# Altium schematic sheet GPS supply2.SchDoc: GPS traker power supply managment
size A4; DrawnBy: Eng. I.Ivanov; Engineer: Eng. I.Ivanov; Revision: 2; SheetNumber: 2; SheetTotal: 3; PageSetup: Record=PageOptions|CenterHorizontal=True|CenterVertical=True|PrintScale=4.01|XCorrection=1.00|YCorrection=1.00|PrintKind=0|BorderSize=5000000|LeftOffset=0|BottomOffset=0|Orientation=2|PaperLength=1000|PaperWidth=1000|Scale=100|PaperSource=15|PrintQuality=1200|MediaType=1|DitherType=10|PaperKind=A0|PrintScaleMode=1
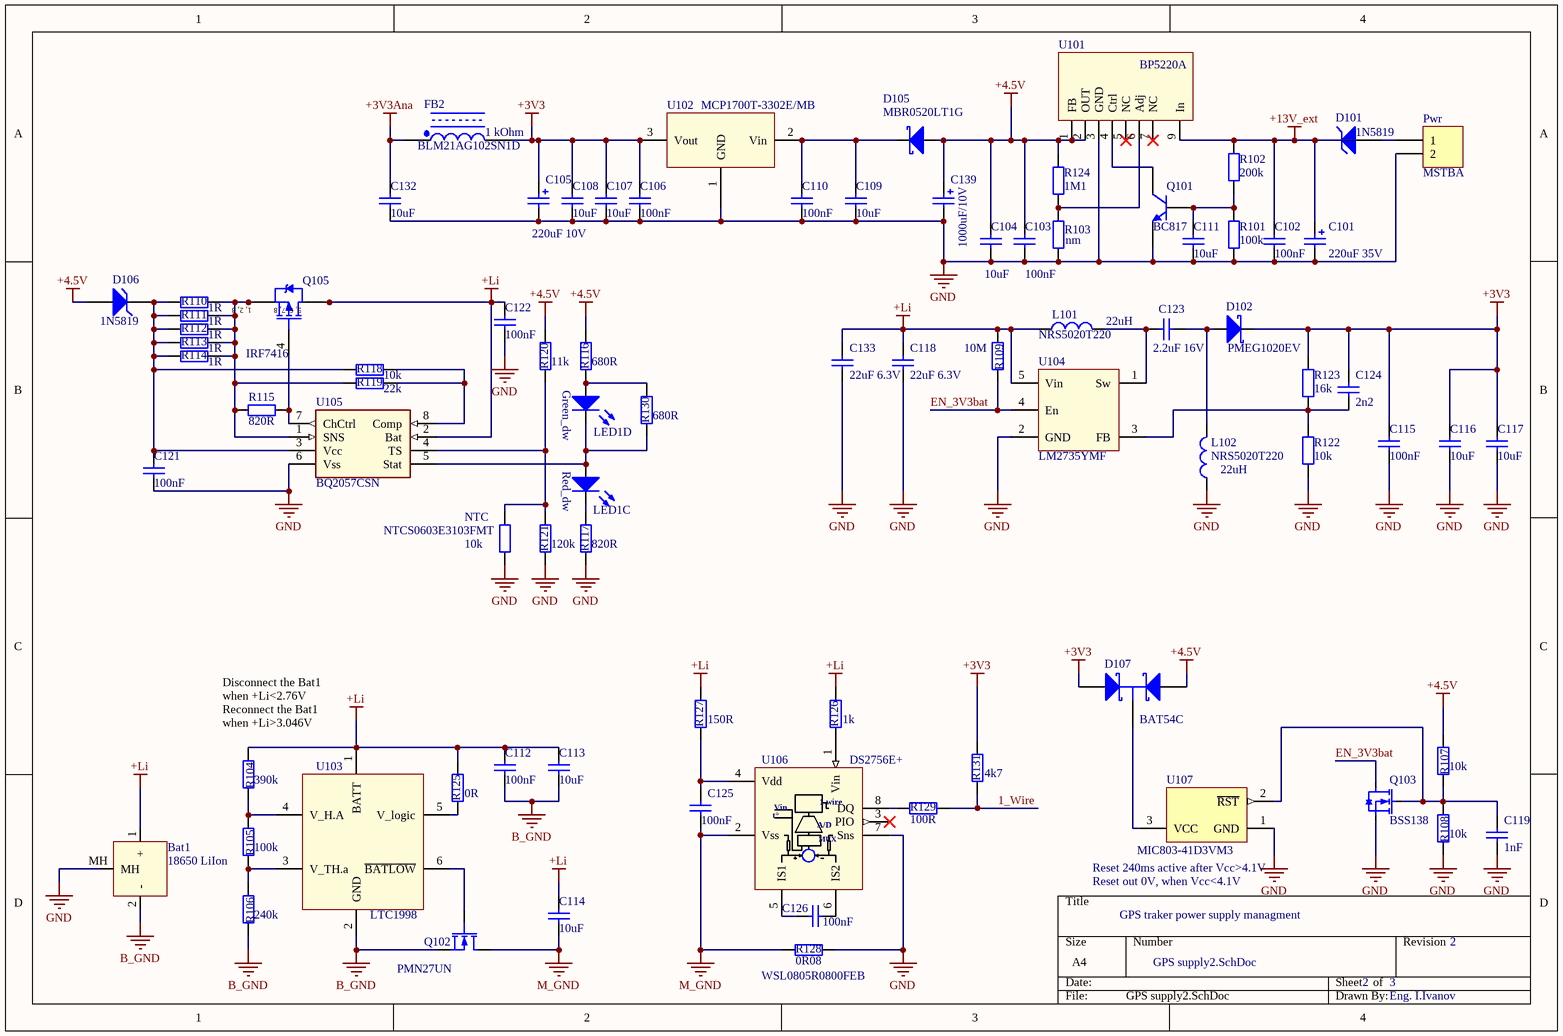
[diagram p0: GPS supply2.SchDoc]

## Parts
Bat1  value 18650 LiIon  [18650]  (hidden comment: LiIon)
C101  220uF 35V  [Cap electrolyt 7]
C102  value 100nF  [2012[0805]]  (hidden comment: Cap Semi)
C103  value 100nF  [2012[0805]]  (hidden comment: Cap Semi)
C104  value 10uF  [2012[0805]]  (hidden comment: Cap Semi)
C105  value 220uF 10V  [Cap electrolyt 8]  (hidden comment: CAP ELECTOLYT)
C106  value 100nF  [2012[0805]]  (hidden comment: Cap Semi)
C107  value 10uF  [2012[0805]]  (hidden comment: Cap Semi)
C108  value 10uF  [2012[0805]]  (hidden comment: Cap Semi)
C109  value 10uF  [2012[0805]]  (hidden comment: Cap Semi)
C110  value 100nF  [2012[0805]]  (hidden comment: Cap Semi)
C111  value 10uF  [2012[0805]]  (hidden comment: Cap Semi)
C112  value 100nF  [2012[0805]]  (hidden comment: Cap Semi)
C113  value 10uF  [2012[0805]]  (hidden comment: Cap Semi)
C114  value 10uF  [2012[0805]]  (hidden comment: Cap Semi)
C115  value 100nF  [2012[0805]]  (hidden comment: Cap Semi)
C116  value 10uF  [2012[0805]]  (hidden comment: Cap Semi)
C117  value 10uF  [2012[0805]]  (hidden comment: Cap Semi)
C118  value 22uF 6.3V  [2012[0805]]  (hidden comment: Cap Semi)
C119  value 1nF  [2012[0805]]  (hidden comment: Cap Semi)
C121  value 100nF  [2012[0805]]  (hidden comment: Cap Semi)
C122  value 100nF  [2012[0805]]  (hidden comment: Cap Semi)
C123  value 2.2uF 16V  [2012[0805]]  (hidden comment: Cap Semi)
C124  value 2n2  [2012[0805]]  (hidden comment: Cap Semi)
C125  value 100nF  [2012[0805]]  (hidden comment: Cap Semi)
C126  value 100nF  [2012[0805]]  (hidden comment: Cap Semi)
C132  value 10uF  [2012[0805]]  (hidden comment: Cap Semi)
C133  value 22uF 6.3V  [2012[0805]]  (hidden comment: Cap Semi)
C139  value 1000uF/10V  [Cap electrolyt 7]  (hidden comment: CAP ELECTOLYT)
D101  1N5819  [DO214]
D102  PMEG1020EV  [SOT-666-DIODE]
D105  MBR0520LT1G  [SOD-123]
D106  1N5819  [DO214]
D107  BAT54C  [SOT23_N]
FB2  BLM21AG102SN1D  value 1 kOhm  [RESC2012N]
L101  value NRS5020T220  Inductance: 22uH  [NRS5020Txxx]  (hidden comment: NRS5020T Taiyo-Yuden inductor)
L102  value NRS5020T220  Inductance: 22uH  [NRS5020Txxx]  (hidden comment: NRS5020T Taiyo-Yuden inductor)
LED1  4x LED's  [515-1061F_2x dual LED's]  (value not drawn)  (parts C,D of 4)
NTC  value 10k  [1608[0603]]  (hidden comment: Res2)
Pwr  MSTBA  [MSTBA2.5/2-G-5.08]
Q101  BC817  [SOT23_N]
Q102  value PMN27UN  [SOT-23-6-MOSFET]  (hidden comment: TrenchMOS™ ultra low level FET)
Q103  value BSS138  [SOT-23_my]  (hidden comment: My BSS138)
Q105  IRF7416  [SO-8_N]
R101  value 100k  [2012[0805]]  (hidden comment: Res2)
R102  value 200k  [2012[0805]]  (hidden comment: Res2)
R103  value nm  [2012[0805]]  (hidden comment: Res2)
R104  value 390k  [2012[0805]]  (hidden comment: Res2)
R105  value 100k  [2012[0805]]  (hidden comment: Res2)
R106  value 240k  [2012[0805]]  (hidden comment: Res2)
R107  value 10k  [2012[0805]]  (hidden comment: Res2)
R108  value 10k  [2012[0805]]  (hidden comment: Res2)
R109  value 10M  [2012[0805]]  (hidden comment: Res2)
R110  value 1R  [2012[0805]]  (hidden comment: Res2)
R111  value 1R  [2012[0805]]  (hidden comment: Res2)
R112  value 1R  [2012[0805]]  (hidden comment: Res2)
R113  value 1R  [2012[0805]]  (hidden comment: Res2)
R114  value 1R  [2012[0805]]  (hidden comment: Res2)
R115  value 820R  [2012[0805]]  (hidden comment: Res2)
R116  value 680R  [2012[0805]]  (hidden comment: Res2)
R117  value 820R  [2012[0805]]  (hidden comment: Res2)
R118  value 10k  [2012[0805]]  (hidden comment: Res2)
R119  value 22k  [2012[0805]]  (hidden comment: Res2)
R120  value 11k  [2012[0805]]  (hidden comment: Res2)
R121  value 120k  [2012[0805]]  (hidden comment: Res2)
R122  value 10k  [2012[0805]]  (hidden comment: Res2)
R123  value 16k  [2012[0805]]  (hidden comment: Res2)
R124  value 1M1  [2012[0805]]  (hidden comment: Res2)
R125  value 0R  [2012[0805]]  (hidden comment: Res2)
R126  value 1k  [2012[0805]]  (hidden comment: Res2)
R127  value 150R  [2012[0805]]  (hidden comment: Res2)
R128  WSL0805R0800FEB  value 0R08  [2012[0805]]
R129  value 100R  [2012[0805]]  (hidden comment: Res2)
R130  value 680R  [2012[0805]]  (hidden comment: Res2)
R131  value 4k7  [2012[0805]]  (hidden comment: Res2)
U101  value BP5220A  [BP502xA]  (hidden comment: Rohm switching DC/DC regulator)
U102  value MCP1700T-3302E/MB  [SOT89_my]  (hidden comment: MCP1700T-xxxx)
U103  value LTC1998  [SOT26A-6N]  (hidden comment: 2.5?A, 1% Accurate  SOT-23 Comparator and Voltage  Reference for Battery Monitoring)
U104  value LM2735YMF  [SOT23-5AN]  (hidden comment: 520kHz Space-Efficient Boost and SEPIC DC-DC  Regulator)
U105  BQ2057CSN  [SO8]
U106  value DS2756E+  [TSSOP 8_My]  (hidden comment: 1 wire fuel gauge)
U107  value MIC803-41D3VM3  [MF03A_N]  (hidden comment: LM809M3-4.00)

## Nets
+3V3: C105.1 C106.2 C107.2 C108.2 C115.2 C116.2 C117.2 C124.2 D102.2(K) D107.2(A2) FB2.2 R123.1 R131.2 U102.3(Vout)
+3V3Ana: C132.2 FB2.1
+4.5V: C103.2 C104.2 C139.1 D105.1(A) D106.1(A) D107.1(A1) R107.2 R116.2 R120.1 R124.1 U101.1(FB) U101.2(OUT)
+13V_ext: C101.1 C102.2 D101.2(K) R102.2 U101.9(In)
+Li: Bat1.1(+) C112.2 C113.2 C114.2 C118.2 C122.2 C133.2 L101.1 Q105.5(D) Q105.6(D) Q105.7(D) Q105.8(D) R104.2 R109.2 R125.1 R126.1 R127.1 U103.1(BATT) U104.5(Vin) U105.2(Bat)
B_GND: Bat1.2(-) C112.1 C113.1 Q102.3(S) R106.1 U103.2(GND)
GND: Bat1.MH C101.2 C102.1 C103.1 C104.1 C105.2 C106.1 C107.1 C108.1 C109.1 C110.1 C111.1 C115.1 C116.1 C117.1 C118.1 C119.1 C121.1 C122.1 C132.1 C133.1 C139.2 L102.1 NTC.2 Pwr.2 Q101.2(E) Q103.2(S) R101.1 R103.1 R108.1 R117.1 R121.2 R122.2 R128.2 U101.3(GND) U102.1(GND) U104.2(GND) U105.6(Vss) U106.7(Sns) U107.1(GND)
M_GND: C114.1 C125.1 Q102.1(D) R128.1 U106.2(Vss)
1_Wire: R129.2 R131.1
EN_3V3bat: Q103.3(D) R109.1 U104.4(En)
NetC109_2: C109.2 C110.2 D105.2(K) U102.2(Vin)
NetC111_2: C111.2 Q101.1(B) R101.2 R102.1
NetC119_2: C119.2 Q103.1(G) R107.1 R108.2 U107.2(~{RST})
NetC121_2: C121.2 D106.2(K) R110.2 R111.2 R112.2 R113.2 R114.2 R118.2 U105.3(Vcc)
NetC123_1: C123.1 D102.1(A) L102.2
NetC123_2: C123.2 L101.2 U104.1(Sw)
NetC124_1: C124.1 R122.1 R123.2 U104.3(FB)
NetC125_2: C125.2 R127.2 U106.4(Vdd)
NetC126_1: C126.1 U106.6(IS2)
NetC126_2: C126.2 U106.5(IS1)
NetD101_1: D101.1(A) Pwr.1
NetD107_3: D107.3(K) U107.3(VCC)
NetLED1_1d: LED1.1d(K) R117.2
NetLED1_2d: LED1.2d(A) LED1.3d(K) R130.1 U105.5(Stat)
NetLED1_4d: LED1.4d(A) R116.1 R130.2
NetNTC_1: NTC.1 R120.2 R121.1 U105.4(TS)
NetQ101_3: Q101.3(C) U101.4(Ctrl)
NetQ102_2: Q102.2(G) U103.6(~{BATLOW})
NetQ105_1: Q105.1(S) Q105.2(S) Q105.3(S) R110.1 R111.1 R112.1 R113.1 R114.1 R115.1 R119.2 U105.1(SNS)
NetQ105_4: Q105.4(G) R115.2 U105.7(ChCtrl)
NetR103_2: R103.2 R124.2 U101.6(Adj)
NetR104_1: R104.1 R105.2 U103.4(V_H.A)
NetR105_1: R105.1 R106.2 U103.3(V_TH.a)
NetR118_1: R118.1 R119.1 U105.8(Comp)
NetR125_2: R125.2 U103.5(V_logic)
NetR126_2: R126.2 U106.1(Vin)
NetR129_1: R129.1 U106.8(DQ)

Not connected (* = marked no-connect by the designer): U101 5(NC)* 7(NC)*; U106 3(PIO)*

## Notes on the sheet
- (near NTC) NTCS0603E3103FMT
- Disconnect the Bat1 when +Li<2.76V
  Reconnect the Bat1 when +Li>3.046V
- (near U107) Reset 240ms active after Vcc>4.1V
- (near U107) Reset out 0V, when Vcc<4.1V
- (in symbol 515-1061F_2x dual LED's, part C) Red_dw
- (in symbol 515-1061F_2x dual LED's, part D) Green_dw
- (in symbol DS2756+) 1 wire; t°; A/D; MUX
- (in symbol IRF7416) 1, 2, 3; 5, 6, 7, 8

## Library data of the parts
Bat1 = LiIon: 18650 cell; created: charge
C101 C105 C139 = CAP ELECTOLYT: Polarized Capacitor (TH); Published: 8-Jun-2000; Revision: July-2002: Re-released for DXP Platform.; Publisher: Altium Limited
  C101: Value: 220uF 35V
C102-C104 C106-C119 C121-C126 C132 C133 = Cap Semi: Capacitor (Semiconductor SIM Model); Published: 8-Jun-2000; LatestRevisionDate: 17-Jul-2002; LatestRevisionNote: Re-released for DXP Platform.; PackageReference: C1206; Publisher: Altium Limited
D101 D106 = BZG05C4V7: Silicon Zener Diode (3W); Published: 8-Jun-2000; LatestRevisionDate: 17-Jul-2002; LatestRevisionNote: Re-released for DXP Platform.; DatasheetDocument: 1-Apr-1999; PackageDocument: Apr-1999; PackageReference: DO214; Publisher: Altium Limited; ComponentLink1Description: Manufacturer Link; ComponentLink1URL: http://www.vishay.com/; ComponentLink2Description: Datasheet; ComponentLink2URL: http://www.vishay.com/docs/85595/85595.pdf
D102 = PMEG1020EV: Ultra low VF MEGA Schottky barrier  rectifier; Order Code: 8737835; Details: 10V, 2A, Uf=0.28V @ 1A; Supplier: Farnell; Price: ˆ0.119; Value: PMEG1020EV
D105 = MBR0520LT1G: Surface Mount  Schottky Power Rectifier; Manufacturer: On Semiconductor; Description: DIODE, SCHOTTKY, 0.5A, 20V, 0.38V@0.5A; Created by: Charge; Supplier: Farnell; Supplier Order code: 9556915; Supplier Price: ˆ0.22; Value: MBR0520LT1G
D107 = BAT54C: Schottky Barrier Double Diode; Published: 17-Sep-2003; LatestRevisionDate: 12-Dec-2006; LatestRevisionNote: IPC-7351 Footprint Added.; DatasheetVersion: 4-Mar-2002; PackageVersion: May-1999; PackageReference: SOT23; Publisher: Altium Limited; PackageDescription: 3-Pin SOT-23 Package 0.95 mm Pitch, 2.3 mm Lead Span; ComponentLink1Description: Manufacturer Link; ComponentLink1URL: http://www.semiconductors.philips.com/; ComponentLink2Description: Datasheet; ComponentLink2URL: http://www.semiconductors.philips.com/acrobat/datasheets/BAT54_SERIES_4.pdf
FB2 = Inductor Isolated: Isolated Inductor; PackageDocument: 1988; Published: 24-Mar-1999; LatestRevisionDate: 17-Jul-2002; LatestRevisionNote: Re-released for DXP Platform.; PackageReference: 425; Publisher: Altium Limited
LED1 = 515-1061F_2x dual LED's: Light pipe manufacturer: Dialight; LED's type: 3x2.5mm leadless, dual, 4 pins; Example LED's 1: SML020 (Rohm); Example LED's 1: 597-77x1-5xx (Dialight); Light pipe: 515-1061F
NTC R101-R131 = Res2: Resistor; Published: 8-Jun-2000; LatestRevisionDate: 17-Jul-2002; LatestRevisionNote: Re-released for DXP Platform.; PackageReference: AXIAL-0.4; Publisher: Altium Limited
Pwr = TS-501 2P: Header, 2-Pin; Revision: 17-Jul-2002: Re-released for DXP Platform.; Publisher: Altium Limited
Q101 = BC817: NPN General-purpose Transistor; Published: 17-Sep-2003; LatestRevisionDate: 12-Dec-2006; LatestRevisionNote: IPC-7351 Footprint Added.; DatasheetVersion: Jun-1999; PackageVersion: May-1999; PackageReference: SOT23; Publisher: Altium Limited; PackageDescription: 3-Pin SOT-23 Package 0.95 mm Pitch, 2.3 mm Lead Span; ComponentLink1Description: Manufacturer Link; ComponentLink1URL: http://www.semiconductors.philips.com/; ComponentLink2Description: Datasheet; ComponentLink2URL: http://www.semiconductors.philips.com/acrobat/datasheets/BC817_BC817W_BC337_5.pdf
Q102 = PMN27UN: TrenchMOS™ ultra low level FET SOT-457; Description: NMOSFET 20V, 5A, Ugs_th=0.7V, Rds=40mOhms; Order Code: 1758104; Supplier: Farnell; Price: ˆ0.156
Q103 = BSS138_my
Q105 = IRF7416: HEXFET Power MOSFET; Published: 8-Jun-2000; LatestRevisionDate: 13-Apr-2006; LatestRevisionNote: IPC-7351 Footprint Added.; DatasheetVersion: Aug-1997; PackageVersion: Feb-2001; PackageReference: SO-8; Publisher: Altium Limited; PackageDescription: 8-Pin Plastic Small Outline Integrated Circuit 1.27 mm Pitch; Code_JEDEC: MS-012-AA; Code_IPC: SOIC127P600-8; ComponentLink1Description: Manufacturer Link; ComponentLink1URL: http://www.irf.com/; ComponentLink2Description: Datasheet; ComponentLink2URL: http://www.irf.com/product-info/datasheets/data/irf7416.pdf; Value: IRF7416
U101 = BP502x_Rohm: BP5220A: 8-38V input 5V 1A out; Order code: BP5020A(BP5220) ROHM; created: charge; Description: Rohm switching DC/DC regulator; Supplier: Comet; Price: 12.75 BGN
U103 = LTC1998: description: 2.5uA, 1% Accurate  SOT-23 Comparator and Voltage  Reference for Battery Monitoring; Order Code: 1663873; Supplier: Farnell; Price: ˆ2.90
U104 = LM2735YMF: Details: 520kHz/1.6MHz – Space-Efficient Boost and SEPIC DC-DC  Regulator
U105 = BQ2057CSN: Advanced charge controller IC; Supplier: Farnell/Comet; Value: BQ2057CSN
U106 = DS2756+: high-precision battery fuel gauge; Manufacturer: Dallas/Maxim Integrated; Order Code: 1455594; Supplier: Farnell; Price: 6.21 ˆ
U107 = LM809M3-4.00: 3-Pin Microprocessor Reset Circuit, 4.00V Threshold; Manufacturer: National Semiconductor; CompType: MiscPower; PackageTopMarking: S6B*XTT; PowerWise: N; FirstPublished: 4-Dec-2008; DatasheetVersion: Sep-2002; PackageVersion: revB, Mar-2003; PackageReference: MF03A; Publisher: Altium Limited; PackageDescription: Molded SOT-23, .115 x .051 x .037in Body, 3 Lead, .075 in Pitch; PartNumber: LM809M3-4.00; RoHS: Y; PinCount: 3; DigiKeyPartNumber: LM809M3-4.00CT-ND; ComponentLink1Description: LM809 Datasheet; ComponentLink1URL: http://www.national.com/ds/LM/LM809.pdf; ComponentLink2Description: LM809 Web Page; ComponentLink2URL: http://www.national.com/mpf/LM/LM809.html; ComponentLink3Description: MF03A Package Page; ComponentLink3URL: http://www.national.com/packaging/folders/mf03a.html
L101 L102 = NRS5020T Taiyo-Yuden inductor: Footprint: 4.9x4.9x2.0mm